# EAGLE schematic gate_boost (EAGLE 6.6.0)
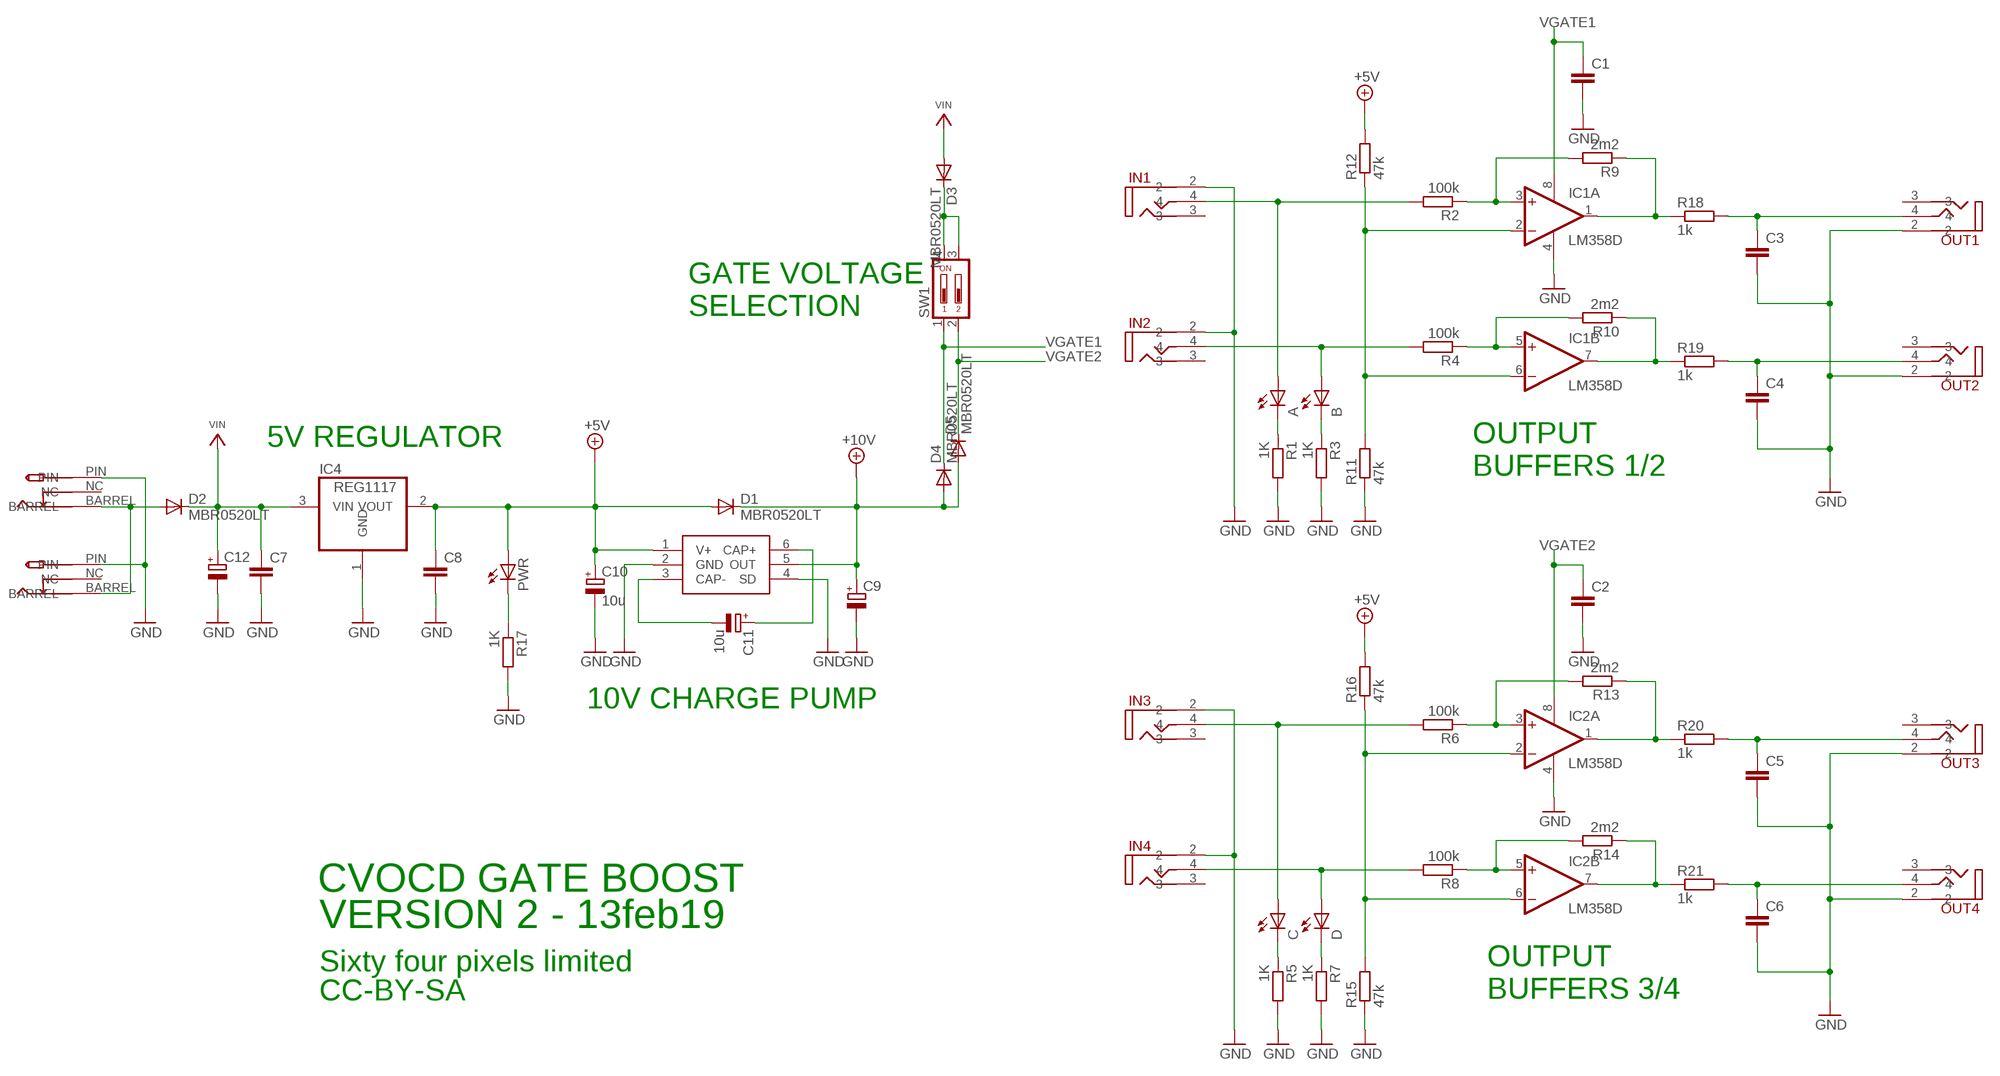
[diagram p0: schematic, sheet 1]

## Parts
A  LED3MM  [LED3MM]
B  LED3MM  [LED3MM]
C  LED3MM  [LED3MM]
C1  C-EUC0805  [C0805]
C2  C-EUC0805  [C0805]
C3  C-EUC0805  [C0805]
C4  C-EUC0805  [C0805]
C5  C-EUC0805  [C0805]
C6  C-EUC0805  [C0805]
C7  C-EUC0805  [C0805]
C8  C-EUC0805  [C0805]
C9  CPOL-EUSMCA  [SMC_A]
C10  10u  CPOL-EUSMCA  [SMC_A]
C11  10u  CPOL-EUSMCA  [SMC_A]
C12  CPOL-EUE2-5  [E2-5]
D  LED3MM  [LED3MM]
D1  MBR0520LT  [SOD123]
D2  MBR0520LT  [SOD123]
D3  MBR0520LT  [SOD123]
D4  MBR0520LT  [SOD123]
D5  MBR0520LT  [SOD123]
IC1  LM358D  [SO08]
IC2  LM358D  [SO08]
IC3  LM27675M5_CHARGEPUMP  [SOT23-6]
IC4  REG1117  [SOT223]
IN1  VERTICAL_3_5MM_SOCKET  [VERTICAL_3_5MM_SOCKET]
IN2  VERTICAL_3_5MM_SOCKET  [VERTICAL_3_5MM_SOCKET]
IN3  VERTICAL_3_5MM_SOCKET  [VERTICAL_3_5MM_SOCKET]
IN4  VERTICAL_3_5MM_SOCKET  [VERTICAL_3_5MM_SOCKET]
OUT1  VERTICAL_3_5MM_SOCKET  [VERTICAL_3_5MM_SOCKET]
OUT2  VERTICAL_3_5MM_SOCKET  [VERTICAL_3_5MM_SOCKET]
OUT3  VERTICAL_3_5MM_SOCKET  [VERTICAL_3_5MM_SOCKET]
OUT4  VERTICAL_3_5MM_SOCKET  [VERTICAL_3_5MM_SOCKET]
PWR  LED3MM  [LED3MM]
R1  1K  R-EU_R0805  [R0805]
R2  100k  R-EU_R0805  [R0805]
R3  1K  R-EU_R0805  [R0805]
R4  100k  R-EU_R0805  [R0805]
R5  1K  R-EU_R0805  [R0805]
R6  100k  R-EU_R0805  [R0805]
R7  1K  R-EU_R0805  [R0805]
R8  100k  R-EU_R0805  [R0805]
R9  2m2  R-EU_R0805  [R0805]
R10  2m2  R-EU_R0805  [R0805]
R11  47k  R-EU_R0805  [R0805]
R12  47k  R-EU_R0805  [R0805]
R13  2m2  R-EU_R0805  [R0805]
R14  2m2  R-EU_R0805  [R0805]
R15  47k  R-EU_R0805  [R0805]
R16  47k  R-EU_R0805  [R0805]
R17  1K  R-EU_R0805  [R0805]
R18  1k  R-EU_R0805  [R0805]
R19  1k  R-EU_R0805  [R0805]
R20  1k  R-EU_R0805  [R0805]
R21  1k  R-EU_R0805  [R0805]
SW1  DIP02YL  [DIP02YL]
U$1  PWR_SOCKET_2_1MM  [PWR_SOCKET_2_1MM]
U$2  PWR_SOCKET_2_1MM  [PWR_SOCKET_2_1MM]

## Nets
+5V: C8.1 C10.+ D1.A IC3.1(V+) IC4.2(VOUT) PWR.A R12.2 R16.2
+10V: C9.+ D1.C D4.A D5.A IC3.5(OUT)
GND: C1.2 C2.2 C3.2 C4.2 C5.2 C6.2 C7.2 C8.2 C9.- C10.- C12.- IC1.4(P:V-) IC2.4(P:V-) IC3.2(GND) IC3.4(SD) IC4.1(GND) IN1.2 IN2.2 IN3.2 IN4.2 OUT1.2 OUT2.2 OUT3.2 OUT4.2 R1.2 R3.2 R5.2 R7.2 R11.1 R15.1 R17.2 U$1.PIN U$2.PIN
IN1: A.A IN1.4 R2.2
IN2: B.A IN2.4 R4.2
IN3: C.A IN3.4 R6.2
IN4: D.A IN4.4 R8.2
N$1: IC1.2(A:-IN) IC1.6(B:-IN) R11.2 R12.1
N$2: A.K(C) R1.1
N$3: B.K(C) R3.1
N$4: IC1.3(A:+IN) R2.1 R9.2
N$5: IC1.5(B:+IN) R4.1 R10.2
N$6: D3.C SW1.3 SW1.4
N$7: C5.1 OUT3.4 R20.2
N$8: C6.1 OUT4.4 R21.2
N$9: IC1.1(A:OUT) R9.1 R18.1
N$10: IC2.7(B:OUT) R14.1 R21.1
N$11: IC2.1(A:OUT) R13.1 R20.1
N$12: IC1.7(B:OUT) R10.1 R19.1
N$13: IC2.2(A:-IN) IC2.6(B:-IN) R15.2 R16.1
N$14: C.K(C) R5.1
N$15: D.K(C) R7.1
N$16: IC2.3(A:+IN) R6.1 R13.2
N$17: IC2.5(B:+IN) R8.1 R14.2
N$19: C3.1 OUT1.4 R18.2
N$20: C4.1 OUT2.4 R19.2
N$21: D2.A U$1.BARREL U$2.BARREL
N$23: PWR.K(C) R17.1
N$38: C11.+ IC3.6(CAP+)
N$39: C11.- IC3.3(CAP-)
VGATE1: C1.1 D4.C IC1.8(P:V+) SW1.1
VGATE2: C2.1 D5.C IC2.8(P:V+) SW1.2
VIN: C7.1 C12.+ D2.C D3.A IC4.3(VIN)
Unconnected: IN1.3 IN2.3 IN3.3 IN4.3 OUT1.3 OUT2.3 OUT3.3 OUT4.3 U$1.NC U$2.NC

## Notes on the sheet
- GATE VOLTAGE 
  SELECTION
- 5V REGULATOR
- OUTPUT 
  BUFFERS 1/2
- 10V CHARGE PUMP
- CVOCD GATE BOOST
- VERSION 2 - 13feb19
- Sixty four pixels limited
- OUTPUT 
  BUFFERS 3/4
- CC-BY-SA

## Library data of the parts
A B C D PWR = led:LED: LED OSRAM: - CHIPLED LG R971, LG N971, LY N971, LG Q971, LY Q971, LO R971, LY R971 LH N974, LH R974 LS Q976, LO Q976, LY Q976 LO Q996 - Hyper CHIPLED LW Q18S LB Q993, LB Q99A, LB R99A - SideLED LS A670, LO A670, LY A670, LG A670, LP A670 LB A673, LV A673, LT A673, LW A673 LH A674 LY A675 LS A676, LA A676, LO A676, LY A676, LW A676 LS A679, LY A679, LG A679 - Hyper Micro SIDELED® LS Y876, LA Y876, LO Y876, LY Y876 LT Y87S - SmartLED LW L88C, LW L88S LB L89C, LB L89S, LG L890 LS L89K, LO L89K, LY L89K LS L896, LA L896, LO L896, LY L896 - TOPLED LS T670, LO T670, LY T670, LG T670, LP T670 LSG T670, LSP T670, LSY T670, LOP T670, LYG T670 LG T671, LOG T671, LSG T671 LB T673, LV T673, LT T673, LW T673 LH T674 LS T676, LA T676, LO T676, LY T676, LB T676, LH T676, LSB T676, LW T676 LB T67C, LV T67C, LT T67C, LS T67K, LO T67K, LY T67K, LW E67C LS E67B, LA E67B, LO E67B, LY E67B, LB E67C, LV E67C, LT E67C LW T67C LS T679, LY T679, LG T679 LS T770, LO T770, LY T770, LG T770, LP T770 LB T773, LV T773, LT T773, LW T773 LH T774 LS E675, LA E675, LY E675, LS T675 LS T776, LA T776, LO T776, LY T776, LB T776 LHGB T686 LT T68C, LB T68C - Hyper Mini TOPLED® LB M676 - Mini TOPLED Santana® LG M470 LS M47K, LO M47K, LY M47K Source: http://www.osram.convergy.de LUXEON: - LUMILED® LXK2-PW12-R00, LXK2-PW12-S00, LXK2-PW14-U00, LXK2-PW14-V00 LXK2-PM12-R00, LXK2-PM12-S00, LXK2-PM14-U00 LXK2-PE12-Q00, LXK2-PE12-R00, LXK2-PE12-S00, LXK2-PE14-T00, LXK2-PE14-U00 LXK2-PB12-K00, LXK2-PB12-L00, LXK2-PB12-M00, LXK2-PB14-N00, LXK2-PB14-P00, LXK2-PB14-Q00 LXK2-PR12-L00, LXK2-PR12-M00, LXK2-PR14-Q00, LXK2-PR14-R00 LXK2-PD12-Q00, LXK2-PD12-R00, LXK2-PD12-S00 LXK2-PH12-R00, LXK2-PH12-S00 LXK2-PL12-P00, LXK2-PL12-Q00, LXK2-PL12-R00 Source: www.luxeon.com KINGBRIGHT: KA-3528ASYC Source: www.kingbright.com
C1-C8 = resistor:C-EU: CAPACITOR, European symbol
C9-C12 = rcl:CPOL-EU: POLARIZED CAPACITOR, European symbol
D1-D5 = diode:MBR0520LT: SCHOTTKY BARRIER RECTIFIER Source: http://onsemi.com .. MBR0520LT1-D.pdf
IC1 IC2 = linear:LM358: OP AMP also LM158; LM258; LM2904 Source: http://cache.national.com/ds/LM/LM158.pdf
IC3 = jason_eagle6:LM27675M5_CHARGEPUMP
IC4 = burr-brown:REG1117: 800mA and 1A Low Dropout (LDO) Positive Regulator 1.8V, 2.5V, 2.85V, 3.3V, 5V, and Adj; MPN: REG1117; OC_FARNELL: 1097566; OC_NEWARK: 14P6981
IN1-IN4 OUT1-OUT4 = jason_eagle6:VERTICAL_3_5MM_SOCKET
R1-R21 = rcl:R-EU_: RESISTOR, European symbol
SW1 = switch-dil:DIP02YL: DIL/CODE SWITCH; OC_FARNELL: unknown; OC_NEWARK: unknown
U$1 U$2 = jason_eagle6:PWR_SOCKET_2_1MM